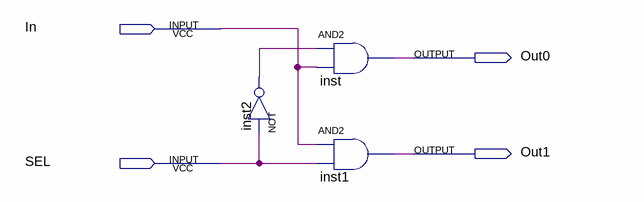
[diagram p0: schematic sheet]
// Quartus schematic mux.bdf as structural Verilog: 3 symbols, 4 pins
module mux (
  input  In,
  input  SEL,
  output Out0,
  output Out1
);

  wire inst2_out;

  not inst2 (inst2_out, SEL);
  and inst (Out0, inst2_out, In);
  and inst1 (Out1, In, SEL);
endmodule
